# EAGLE design CAN Line (EAGLE 8.4.3)
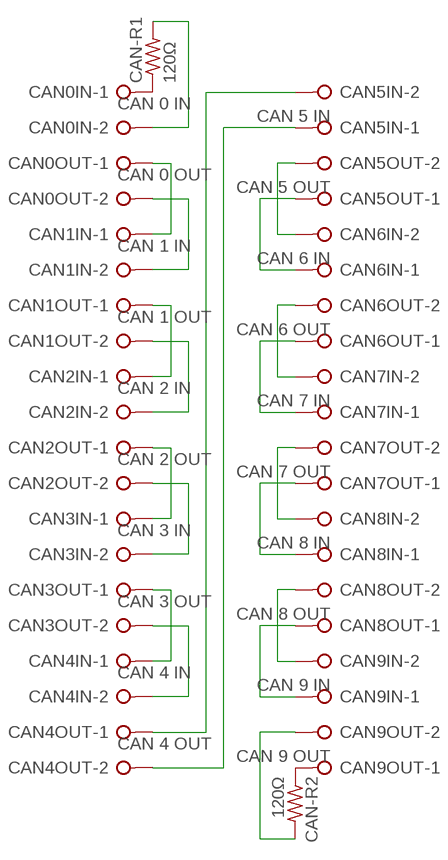
[diagram p0: schematic, sheet 1]

## Parts
CAN0IN  CAN 0 IN  W237-02P  [W237-132]
CAN0OUT  CAN 0 OUT  W237-02P  [W237-132]
CAN1IN  CAN 1 IN  W237-02P  [W237-132]
CAN1OUT  CAN 1 OUT  W237-02P  [W237-132]
CAN2IN  CAN 2 IN  W237-02P  [W237-132]
CAN2OUT  CAN 2 OUT  W237-02P  [W237-132]
CAN3IN  CAN 3 IN  W237-02P  [W237-132]
CAN3OUT  CAN 3 OUT  W237-02P  [W237-132]
CAN4IN  CAN 4 IN  W237-02P  [W237-132]
CAN4OUT  CAN 4 OUT  W237-02P  [W237-132]
CAN5IN  CAN 5 IN  W237-02P  [W237-132]
CAN5OUT  CAN 5 OUT  W237-02P  [W237-132]
CAN6IN  CAN 6 IN  W237-02P  [W237-132]
CAN6OUT  CAN 6 OUT  W237-02P  [W237-132]
CAN7IN  CAN 7 IN  W237-02P  [W237-132]
CAN7OUT  CAN 7 OUT  W237-02P  [W237-132]
CAN8IN  CAN 8 IN  W237-02P  [W237-132]
CAN8OUT  CAN 8 OUT  W237-02P  [W237-132]
CAN9IN  CAN 9 IN  W237-02P  [W237-132]
CAN9OUT  CAN 9 OUT  W237-02P  [W237-132]
CAN-R1  120Ω  R-US_0207/10  [0207/10]
CAN-R2  120Ω  R-US_0207/10  [0207/10]

## Nets
N$1: CAN0IN.1 CAN-R1.1
N$2: CAN0IN.2 CAN-R1.2
N$3: CAN0OUT.1 CAN1IN.1
N$4: CAN0OUT.2 CAN1IN.2
N$5: CAN1OUT.1 CAN2IN.1
N$6: CAN1OUT.2 CAN2IN.2
N$7: CAN2OUT.1 CAN3IN.1
N$8: CAN2OUT.2 CAN3IN.2
N$9: CAN3OUT.1 CAN4IN.1
N$10: CAN3OUT.2 CAN4IN.2
N$11: CAN4OUT.1 CAN5IN.2
N$12: CAN4OUT.2 CAN5IN.1
N$13: CAN5OUT.2 CAN6IN.2
N$14: CAN5OUT.1 CAN6IN.1
N$15: CAN6OUT.2 CAN7IN.2
N$16: CAN6OUT.1 CAN7IN.1
N$17: CAN7OUT.2 CAN8IN.2
N$18: CAN7OUT.1 CAN8IN.1
N$19: CAN8OUT.2 CAN9IN.2
N$20: CAN8OUT.1 CAN9IN.1
N$21: CAN9OUT.2 CAN-R2.2
N$22: CAN9OUT.1 CAN-R2.1

## Library data of the parts
CAN0IN CAN0OUT CAN1IN CAN1OUT CAN2IN CAN2OUT CAN3IN CAN3OUT CAN4IN CAN4OUT CAN5IN CAN5OUT CAN6IN CAN6OUT CAN7IN CAN7OUT CAN8IN CAN8OUT CAN9IN CAN9OUT = con-wago-508:W237-02P: WAGO SREW CLAMP; OC_FARNELL: unknown; OC_NEWARK: unknown
CAN-R1 CAN-R2 = resistor:R-US_: RESISTOR, American symbol

## Board
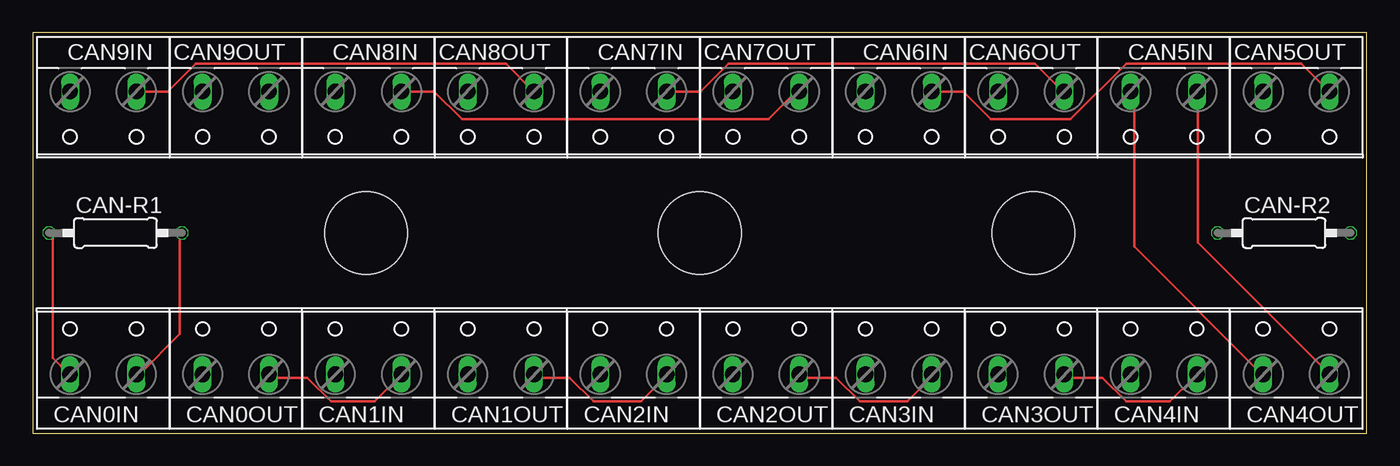
[diagram p1: board, top side]
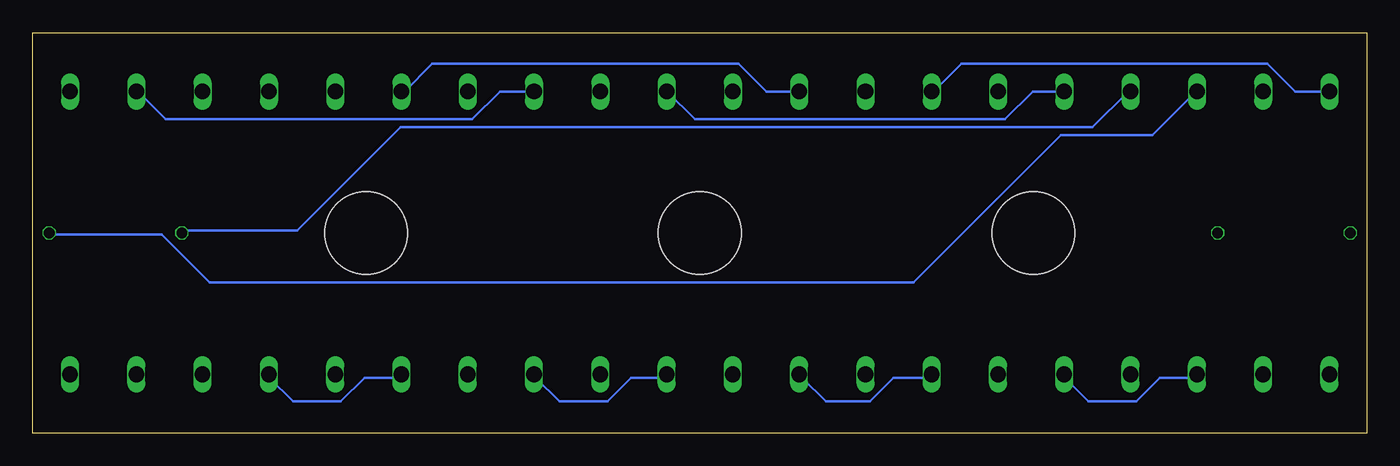
[diagram p2: board, bottom side, seen from below]

Size 102.26 x 30.73 mm. Coordinates in mm from the lower left corner, seen from the top.
Outline: 0,0 102.26,0 102.26,30.73 0,30.73 0,0
Copper layers (1*16): Top 0.0356mm / dielectric 1.5011mm / Bottom 0.0356mm
Design rules "TEST": minimum track width 8mil, minimum drill 12mil, track to track 16mil, track to pad 16mil, pad to pad 8mil, via to via 8mil, smd to smd 0mil, copper to edge 20mil, drill to drill 12mil, minimum pad ring 4mil, minimum via ring 8mil, stop-mask expansion 4mil, vias tented up to drill 0mil, thermal gap 10mil
Holes 6.35 mm at 51.13,15.37 76.7,15.37 25.57,15.37

### Footprints (pad centres in the part's own frame; a part is rotated, then mirrored left to right if it is on the bottom)
W237-132 = drill 1.194 long: 1 -2.54,-0.635; 2 2.54,-0.635
0207/10 = drill 0.813 octagon: 1 -5.08,0; 2 5.08,0

### Placement (x,y rotation side)
CAN0IN  5.41,5.16 0 top
CAN0OUT  15.57,5.16 0 top
CAN1IN  25.73,5.16 0 top
CAN1OUT  35.89,5.16 0 top
CAN2IN  46.05,5.16 0 top
CAN2OUT  56.21,5.16 0 top
CAN3IN  66.37,5.16 0 top
CAN3OUT  76.53,5.16 0 top
CAN4IN  86.69,5.16 0 top
CAN4OUT  96.85,5.16 0 top
CAN5IN  86.69,25.58 180 top
CAN5OUT  96.85,25.58 180 top
CAN6IN  66.37,25.58 180 top
CAN6OUT  76.53,25.58 180 top
CAN7IN  46.05,25.58 180 top
CAN7OUT  56.21,25.58 180 top
CAN8IN  25.73,25.58 180 top
CAN8OUT  35.89,25.58 180 top
CAN9IN  5.41,25.58 180 top
CAN9OUT  15.57,25.58 180 top
CAN-R1  6.35,15.37 0 top
CAN-R2  95.91,15.37 0 top

### Tracks (layer width: path | path; a pad name or v marks a point on that pad's centre or on a via)
N$1
  Top 0.203: CAN-R1.1 1.52,15.24 1.52,5.79 2.74,4.57 CAN0IN.1
N$2
  Top 0.203: CAN-R1.2 11.28,15.24 11.28,7.62 8.23,4.57 CAN0IN.2
N$3
  Bottom 0.203: CAN0OUT.1 13.11,4.27 15.85,4.27 17.68,2.44 21.34,2.44 23.16,4.27 CAN1IN.1
N$4
  Top 0.203: CAN0OUT.2 18.29,4.27 21.03,4.27 22.86,2.44 26.21,2.44 28.04,4.27 CAN1IN.2
N$5
  Bottom 0.203: CAN1OUT.1 33.53,4.27 36.27,4.27 38.1,2.44 41.45,2.44 43.28,4.27 CAN2IN.1
N$6
  Top 0.203: CAN1OUT.2 38.71,4.27 41.15,4.27 42.98,2.44 46.63,2.44 48.46,4.27 CAN2IN.2
N$7
  Bottom 0.203: CAN2OUT.1 53.95,4.27 56.39,4.27 58.22,2.44 61.87,2.44 63.7,4.27 CAN3IN.1
N$8
  Top 0.203: CAN2OUT.2 58.83,4.27 61.57,4.27 63.4,2.44 67.06,2.44 68.89,4.27 CAN3IN.2
N$9
  Bottom 0.203: CAN3OUT.1 74.07,4.27 76.81,4.27 78.64,2.44 82.3,2.44 84.12,4.27 CAN4IN.1
N$10
  Top 0.203: CAN3OUT.2 79.25,4.27 81.99,4.27 83.82,2.44 87.17,2.44 89,4.27 CAN4IN.2
N$11
  Top 0.203: CAN5IN.2 84.43,26.21 84.43,14.33 94.18,4.57 CAN4OUT.1
N$12
  Top 0.203: CAN5IN.1 89.31,26.21 89.31,14.63 99.36,4.57 CAN4OUT.2
N$13
  Bottom 0.203: CAN6IN.2 66.45,26.21 68.58,24.08 92.05,24.08 94.18,26.21 CAN5OUT.2
N$14
  Top 0.203: CAN6IN.1 71.32,26.21 73.46,24.08 79.55,24.08 83.82,28.35 97.23,28.35 99.36,26.21 CAN5OUT.1
N$15
  Bottom 0.203: CAN7IN.2 46.02,26.21 48.16,28.35 71.63,28.35 73.76,26.21 CAN6OUT.2
N$16
  Top 0.203: CAN7IN.1 51.21,26.21 53.34,28.35 76.81,28.35 78.94,26.21 CAN6OUT.1
N$17
  Bottom 0.203: CAN8IN.2 25.6,26.21 27.74,24.08 51.51,24.08 53.65,26.21 CAN7OUT.2
N$18
  Top 0.203: CAN8IN.1 30.79,26.21 32.92,24.08 56.39,24.08 58.52,26.21 CAN7OUT.1
N$19
  Bottom 0.203: CAN9IN.2 5.49,26.21 7.62,28.35 31.09,28.35 33.22,26.21 CAN8OUT.2
N$20
  Top 0.203: CAN9IN.1 10.36,26.21 12.5,28.35 36.27,28.35 38.41,26.21 CAN8OUT.1
N$21
  Bottom 0.203: CAN-R2.2 100.89,15.24 92.35,15.24 88.7,11.58 34.75,11.58 23.47,22.86 16.46,22.86 13.11,26.21 CAN9OUT.2
N$22
  Bottom 0.203: CAN-R2.1 90.83,15.54 81.99,15.54 74.07,23.47 21.03,23.47 18.29,26.21 CAN9OUT.1

### Text on the board
tValues: RoboLoCo / team5338.org | Line / Board v1